# EAGLE design NanoMySens-v016 (EAGLE 7.6.0)
MAPLE-CUx Large Version
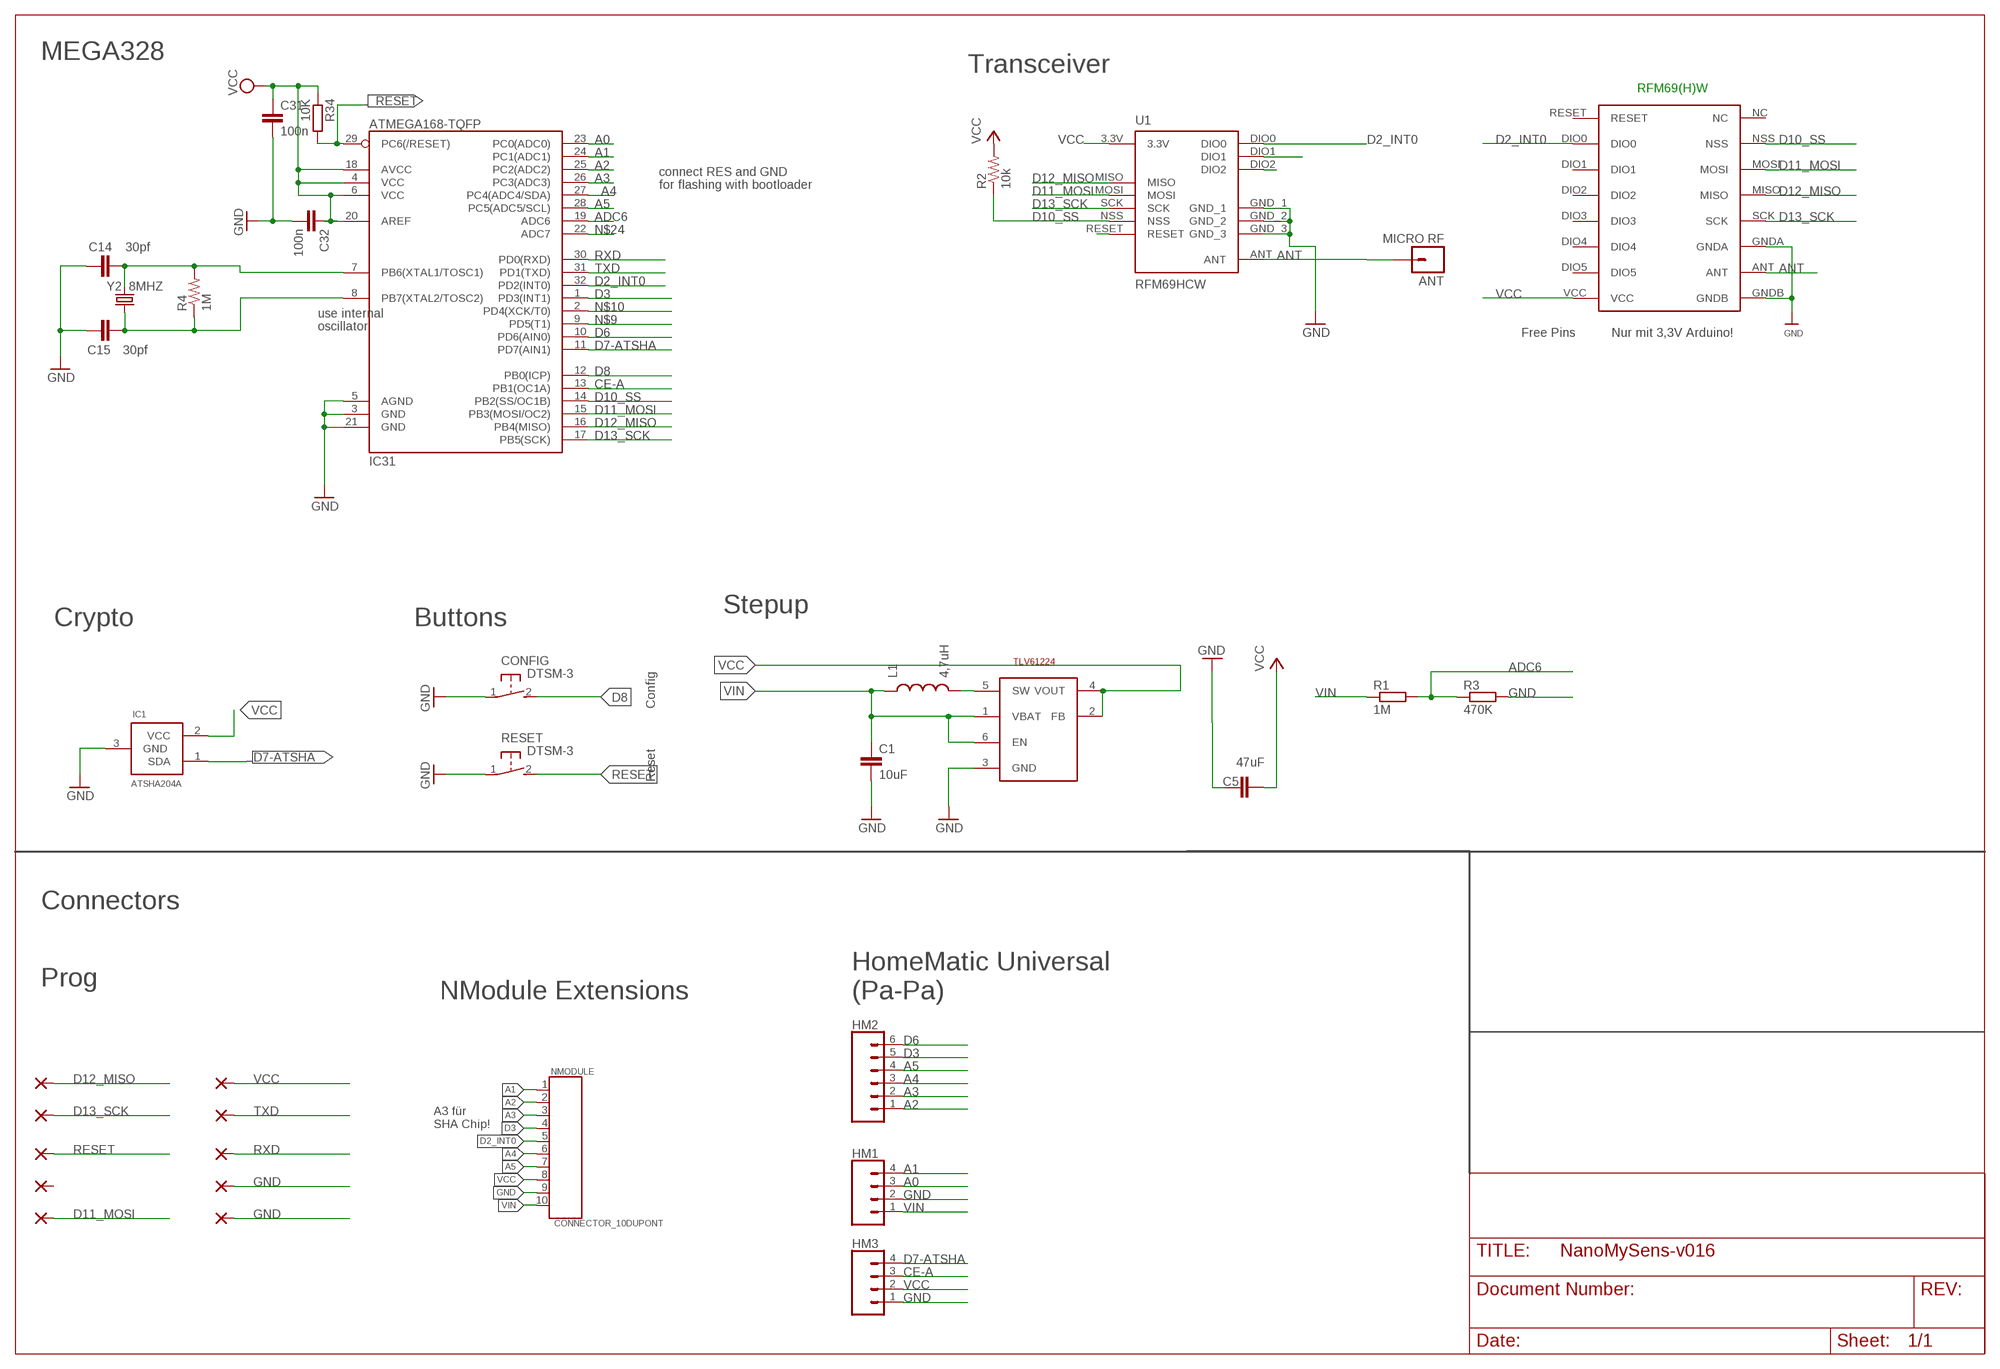
[diagram p0: schematic, sheet 1]

## Parts
ANT  MICRO RF  M01PTH  [1X01]
C1  10uF  CAP0805  [0805]
C5  47uF  C-EUC1210  [C1210]
C14  30pf  CAP0805  [0805]
C15  30pf  CAP0805  [0805]
C31  100n  C-EUC0805  [C0805]
C32  100n  C-EUC0805  [C0805]
CONFIG  DTSM-3  [DTSM-3]
GND  WIREPADSMD1,27-254  [SMD1,27-2,54]
GND2  WIREPADSMD1,27-254  [SMD1,27-2,54]
HM1  CONN_04  [1X04]
HM2  CONN_06SILK_FEMALE_PTH  [1X06]
HM3  CONN_04  [1X04]
IC1  ATSHA204A  [SOT23]
IC31  ATMEGA168-TQFP  [TQFP32-08]
L1  4,7uH  INDUCTOR0805  [0805]
MISO  WIREPADSMD1,27-254  [SMD1,27-2,54]
MOSI  WIREPADSMD1,27-254  [SMD1,27-2,54]
NC  WIREPADSMD1,27-254  [SMD1,27-2,54]
NMODULE  CONNECTOR_10DUPONT  [DUPONT_10]
R1  1M  R-EU_R0805  [R0805]
R2  10k  RESISTOR0805-RES  [0805]
R3  470K  R-EU_R0805  [R0805]
R4  1M  RESISTOR0805-RES  [0805]
R34  10K  R-EU_R0805  [R0805]
RESET  DTSM-3  [DTSM-3]
RFM69W  RFM69HW  [RFM]
RST  WIREPADSMD1,27-254  [SMD1,27-2,54]
RXD  WIREPADSMD1,27-254  [SMD1,27-2,54]
SCK  WIREPADSMD1,27-254  [SMD1,27-2,54]
STEPUP  TLV61224  TI-TLV61224  [SOT23-6L]
TXD  WIREPADSMD1,27-254  [SMD1,27-2,54]
U1  RFM69HCW  [RFM69HCW-XXXS2]
VCC  WIREPADSMD1,27-254  [SMD1,27-2,54]
Y2  8MHZ  CRYSTALTXC-7A  [CRYSTAL-TXC-7A]

## Nets
A0: HM1.3 IC31.23(PC0(ADC0))
A1: HM1.4 IC31.24(PC1(ADC1)) NMODULE.1
A2: HM2.1 IC31.25(PC2(ADC2)) NMODULE.2
A3: HM2.2 IC31.26(PC3(ADC3)) NMODULE.3
A4: HM2.3 IC31.27(PC4(ADC4/SDA)) NMODULE.6
A5: HM2.4 IC31.28(PC5(ADC5/SCL)) NMODULE.7
ADC6: IC31.19(ADC6) R1.2 R3.1
ANT: ANT.1 RFM69W.ANT U1.ANT
CE-A: HM3.3 IC31.13(PB1(OC1A))
D2_INT0: IC31.32(PD2(INT0)) NMODULE.5 RFM69W.DIO0 U1.DIO0
D3: HM2.5 IC31.1(PD3(INT1)) NMODULE.4
D6: HM2.6 IC31.10(PD6(AIN0))
D7-ATSHA: HM3.4 IC1.1(SDA) IC31.11(PD7(AIN1))
D8: CONFIG.2 IC31.12(PB0(ICP))
D10_SS: IC31.14(PB2(SS/OC1B)) R2.1 RFM69W.NSS U1.NSS
D11_MOSI: IC31.15(PB3(MOSI/OC2)) MOSI.1(P) RFM69W.MOSI U1.MOSI
D12_MISO: IC31.16(PB4(MISO)) MISO.1(P) RFM69W.MISO U1.MISO
D13_SCK: IC31.17(PB5(SCK)) RFM69W.SCK SCK.1(P) U1.SCK
GND [PWR]: C1.2 C5.1 C14.1 C15.1 C31.2 C32.2 CONFIG.1 GND2.1(P) GND.1(P) HM1.2 HM3.1 IC1.3(GND) IC31.3(GND) IC31.5(AGND) IC31.21(GND) NMODULE.9 R3.2 RESET.1 RFM69W.GNDA RFM69W.GNDB STEPUP.3(GND) U1.GND_1 U1.GND_2 U1.GND_3
N$3: C14.2 IC31.7(PB6(XTAL1/TOSC1)) R4.2 Y2.P$2
N$9: IC31.9(PD5(T1))
N$10: IC31.2(PD4(XCK/T0))
N$13: L1.2 STEPUP.5(SW)
N$14: U1.DIO2
N$15: U1.DIO1
N$16: U1.RESET
N$19: C15.2 IC31.8(PB7(XTAL2/TOSC2)) R4.1 Y2.P$1
N$24: IC31.22(ADC7)
RESET: IC31.29(PC6(/RESET)) R34.2 RESET.2 RST.1(P)
RXD: IC31.30(PD0(RXD)) RXD.1(P)
TXD: IC31.31(PD1(TXD)) TXD.1(P)
VCC [PWR]: C5.2 C31.1 C32.1 HM3.2 IC1.2(VCC) IC31.4(VCC) IC31.6(VCC) IC31.18(AVCC) IC31.20(AREF) NMODULE.8 R2.2 R34.1 RFM69W.VCC STEPUP.2(FB) STEPUP.4(VOUT) U1.3.3V VCC.1(P)
VIN [PWR]: C1.1 HM1.1 L1.1 NMODULE.10 R1.1 STEPUP.1(VBAT) STEPUP.6(EN)
Unconnected: NC.1(P) RFM69W.DIO1 RFM69W.DIO2 RFM69W.DIO3 RFM69W.DIO4 RFM69W.DIO5 RFM69W.NC RFM69W.RESET

## Notes on the sheet
- MEGA328
- Transceiver
- RFM69(H)W
- connect RES and GND
- for flashing with bootloader
- use internal
- oscillator
- Free Pins | Nur mit 3,3V Arduino!
- Stepup
- Crypto | Buttons
- Config
- Reset
- Connectors
- Prog
- NModule Extensions
- HomeMatic Universal
  (Pa-Pa)
- A3 für 
  SHA Chip!

## Library data of the parts
ANT = SparkFun-Connectors:M01: Header 1 Standard 1-pin 0.1" header. Use with straight break away headers (SKU : PRT-00116), right angle break away headers (PRT-00553), swiss pins (PRT-00743), machine pins (PRT-00117), and female headers (PRT-00115).
C1 = SparkFun-Passives:CAP: Capacitor Standard 0603 ceramic capacitor, and 0.1" leaded capacitor.
C5 C31 C32 = rcl:C-EU: CAPACITOR, European symbol
C14 C15 = doug:CAP: Capacitor Standard 0603 ceramic capacitor, and 0.1" leaded capacitor.
CONFIG RESET = mechanics:DTSM-3: Diptronics SMD button 6x3.5 mm
GND GND2 MISO MOSI NC RST RXD SCK TXD VCC = wirepad:WIREPAD: Wire PAD connect wire on PCB
HM1 HM3 = SparkFun-Connectors:CONN_04: Multi connection point. Often used as Generic Header-pin footprint for 0.1 inch spaced/style header connections On any of the 0.1 inch spaced packages, you can populate with these: Break Away Headers - Straight <https://www.sparkfun.com/products/116> (PRT-00116) Break Away Male Headers - Right Angle <https://www.sparkfun.com/products/553> (PRT-00553) Female Headers <https://www.sparkfun.com/products/115> (PRT-00115) Break Away Headers - Machine Pin <https://www.sparkfun.com/products/117> (PRT-00117) Break Away Female Headers - Swiss Machine Pin <https://www.sparkfun.com/products/743> (PRT-00743) For SCREWTERMINALS and SPRING TERMINALS visit here: Screw Terimnals on SparkFun.com <https://www.sparkfun.com/search/results?term=Screw+Terminals> (5mm/3.5mm/2.54mm spacing) This device is also useful as a general connection point to wire up your design to another part of your project. Our various solder wires solder well into these plated through hole pads. Hook-Up Wire - Assortment (Stranded, 22 AWG) <https://www.sparkfun.com/products/11375> (PRT-11375) Hook-Up Wire - Assortment (Solid Core, 22 AWG) <https://www.sparkfun.com/products/11367> (PRT-11367) View the entire wire category on our website here <https://www.sparkfun.com/categories/141> Special notes: Molex polarized connector foot print use with SKU : PRT-08231 with associated crimp pins and housings. 1MM SMD Version SKU: PRT-10208; PROD_ID: CONN-09696
HM2 = SparkFun-Connectors:CONN_06: Multi connection point. Often used as Generic Header-pin footprint for 0.1 inch spaced/style header connections On any of the 0.1 inch spaced packages, you can populate with these: Break Away Headers - Straight <https://www.sparkfun.com/products/116> (PRT-00116) Break Away Male Headers - Right Angle <https://www.sparkfun.com/products/553> (PRT-00553) Female Headers <https://www.sparkfun.com/products/115> (PRT-00115) Break Away Headers - Machine Pin <https://www.sparkfun.com/products/117> (PRT-00117) Break Away Female Headers - Swiss Machine Pin <https://www.sparkfun.com/products/743> (PRT-00743) Arduino Stackable Header - 6 Pin <https://www.sparkfun.com/products/9280> (PRT-09280) For SCREWTERMINALS and SPRING TERMINALS visit here: Screw Terimnals on SparkFun.com <https://www.sparkfun.com/search/results?term=Screw+Terminals> (5mm/3.5mm/2.54mm spacing) This device is also useful as a general connection point to wire up your design to another part of your project. Our various solder wires solder well into these plated through hole pads. Hook-Up Wire - Assortment (Stranded, 22 AWG) <https://www.sparkfun.com/products/11375> (PRT-11375) Hook-Up Wire - Assortment (Solid Core, 22 AWG) <https://www.sparkfun.com/products/11367> (PRT-11367) View the entire wire category on our website here <https://www.sparkfun.com/categories/141>; PROD_ID: CONN-08437
IC1 = Sensor:ATSHA204A
IC31 = atmel:ATMEGA168: Atmel Atmega 168/328/328P
L1 = SparkFun-Passives:INDUCTOR: Inductors Basic Inductor/Choke - 0603 and 1206. Footprints are not proven and vary greatly between part numbers.
NMODULE = TD-MySensors:CONNECTOR_10
R1 R3 R34 = rcl:R-EU_: RESISTOR, European symbol
R2 R4 = doug:RESISTOR: Resistor Basic schematic elements and footprints for 0603, 1206, and PTH resistors.
RFM69W = hoperf:RFM69HW
STEPUP = TLV61224:TI-TLV61224
U1 = doug:RFM69H
Y2 = SparkFun-FreqCtrl:CRYSTAL: Various standard crystals. Proven footprints.

## Net classes
0 default: width 0.305 mm
1 PWR: width 0.457 mm

## Board
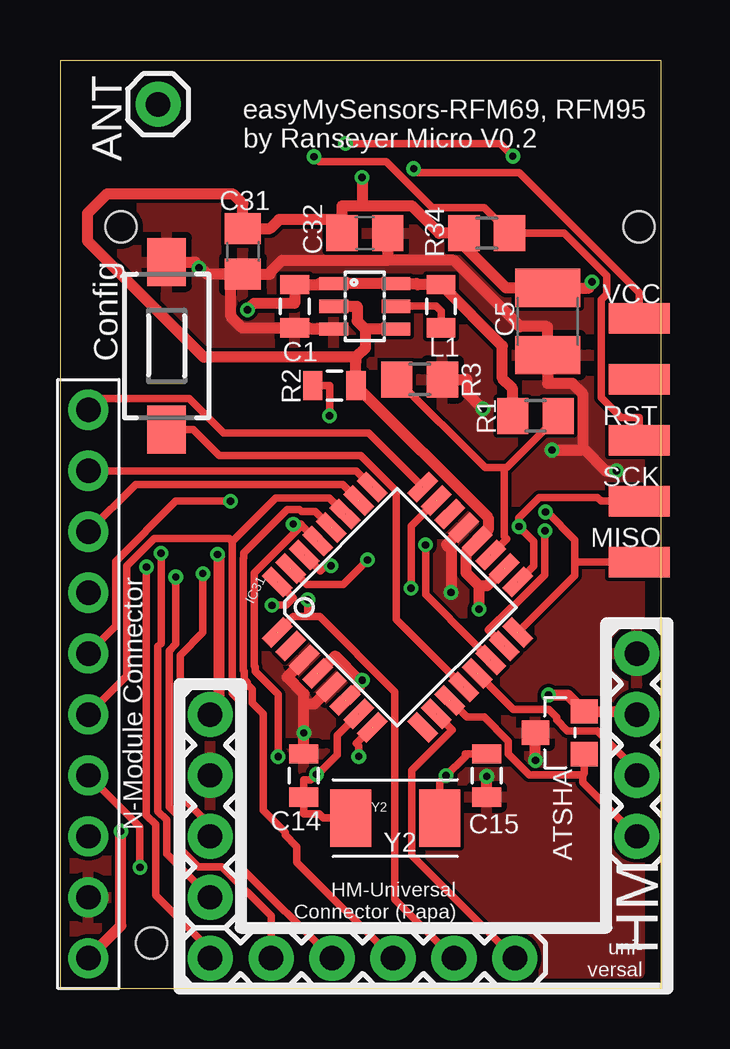
[diagram p1: board, top side]
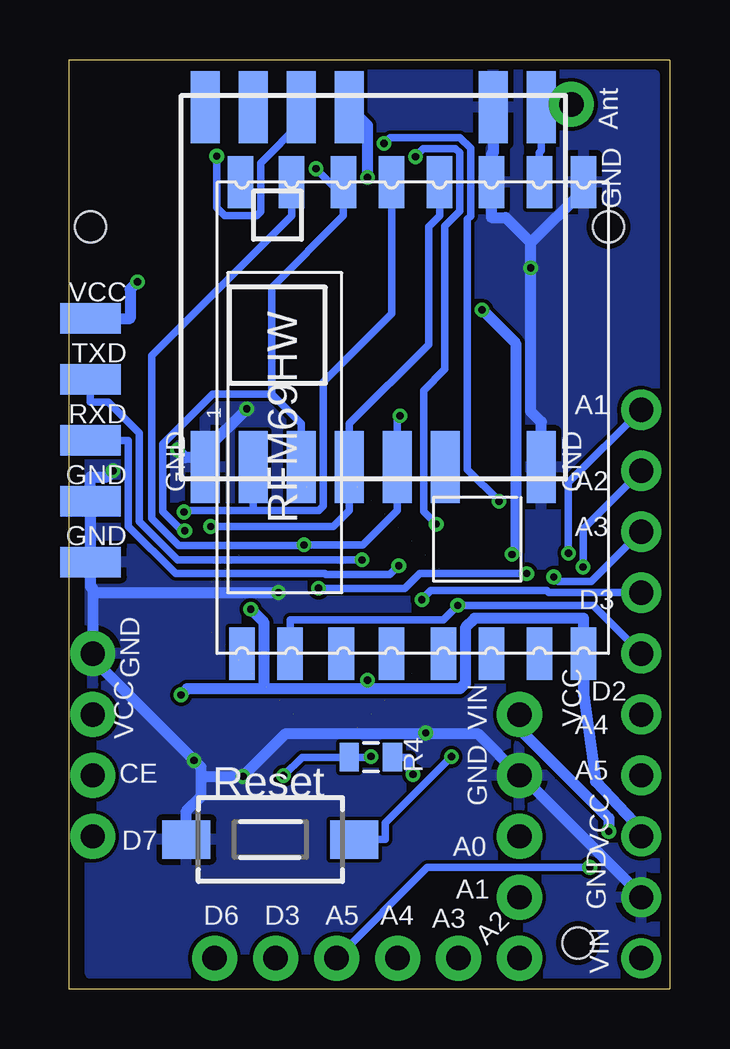
[diagram p2: board, bottom side, seen from below]

Size 25.04 x 38.72 mm. Coordinates in mm from the lower left corner, seen from the top.
Outline: 25.04,38.72 25.04,0 0,0 0,38.72 25.04,38.72
Copper layers (1*16): Top 0.035mm / dielectric 1.5mm / Bottom 0.035mm
Design rules "SeeedStudio_2layer_DRU_no_angle_20140221": minimum track width 6mil, minimum drill 12mil, track to track 6mil, track to pad 6mil, pad to pad 6mil, via to via 6mil, smd to smd 0mil, copper to edge 10mil, drill to drill 10mil, minimum pad ring 10mil, minimum via ring 6mil, stop-mask expansion 2mil, vias tented up to drill 100mil, thermal gap 10mil
Holes 1.3 mm at 24.13,31.75 2.54,31.75 3.81,1.91

### Footprints (pad centres in the part's own frame; a part is rotated, then mirrored left to right if it is on the bottom)
1X01 = drill 1.016 pad 1.88: 1 0,0
0805 = smd 0.8 x 1.2: 1 -0.9,0; 2 0.9,0
C1210 = smd 1.6 x 2.7: 1 -1.4,0; 2 1.4,0
C0805 = smd 1.3 x 1.5: 1 -0.95,0; 2 0.95,0
DTSM-3 = smd 2 x 1.6: 1 -3.494,0; 2 3.494,0
SMD1,27-2,54 = smd 1.27 x 2.54: 1 0,0
1X04 = drill 1.016 pad 1.88: 1 0,0; 2 2.54,0; 3 5.08,0; 4 7.62,0
1X06 = drill 1.016 pad 1.88: 1 0,0; 2 2.54,0; 3 5.08,0; 4 7.62,0; 5 10.16,0; 6 12.7,0
SOT23 = smd 1.016 x 1.143: 1 -0.889,-1.016; 2 0.889,-1.016; 3 0,1.016
TQFP32-08 = smd 1.27 x 0.559: 1 -4.293,2.8; 2 -4.293,2; 3 -4.293,1.2; 4 -4.293,0.4; 5 -4.293,-0.4; 6 -4.293,-1.2; 7 -4.293,-2; 8 -4.293,-2.8; 17 4.293,-2.8; 18 4.293,-2; 19 4.293,-1.2; 20 4.293,-0.4; 21 4.293,0.4; 22 4.293,1.2; 23 4.293,2; 24 4.293,2.8 | smd 0.559 x 1.27: 9 -2.8,-4.293; 10 -2,-4.293; 11 -1.2,-4.293; 12 -0.4,-4.293; 13 0.4,-4.293; 14 1.2,-4.293; 15 2,-4.293; 16 2.8,-4.293; 25 2.8,4.293; 26 2,4.293; 27 1.2,4.293; 28 0.4,4.293; 29 -0.4,4.293; 30 -1.2,4.293; 31 -2,4.293; 32 -2.8,4.293
DUPONT_10 = drill 1.016 pad 1.676: 1 1.27,1.27; 2 3.81,1.27; 3 6.35,1.27; 4 8.89,1.27; 5 11.43,1.27; 6 13.97,1.27; 7 16.51,1.27; 8 19.05,1.27; 9 21.59,1.27; 10 24.13,1.27
R0805 = smd 1.3 x 1.5: 1 -0.95,0; 2 0.95,0
RFM = smd 2.184 x 1.067: ANT 19.651,2.889; DIO0 0,13.27; DIO1 0,11.143; DIO2 0,9.047; DIO3 0,6.889; DIO4 0,4.889; DIO5 0,2.889; GNDA 19.651,4.889; GNDB 19.651,1.048; MISO 19.651,9.047; MOSI 19.651,11.047; NC 19.651,15.334; NSS 19.651,13.206; RESET 0,15.27; SCK 19.651,7.048; VCC 0,1.048
SOT23-6L = smd 0.55 x 1.2: 1 -0.95,-1.3; 2 0,-1.3; 3 0.95,-1.3; 4 0.95,1.3; 5 0,1.3; 6 -0.95,1.3
RFM69HCW-XXXS2 = smd 3 x 1.2: 3.3V 7.5,1; ANT 7.5,-7; DIO0 7.5,3; DIO1 7.5,5; DIO2 7.5,7; GND_1 7.5,-5; GND_2 -7.5,-7; GND_3 -7.5,7; MISO -7.5,5; MOSI -7.5,3; NSS -7.5,-1; RESET -7.5,-3; SCK -7.5,1
CRYSTAL-TXC-7A = smd 1.7 x 2.4: P$1 1.85,0; P$2 -1.85,0

### Placement (x,y rotation side)
ANT  4.09,36.87 0 top
C1  9.78,28.45 270 top
C5  20.32,27.81 90 top
C14  10.16,8.89 270 top
C15  17.78,8.89 90 top
C31  7.62,30.73 270 top
C32  12.7,31.5 0 top
CONFIG  4.45,26.8 270 top
GND  24.13,17.78 90 bottom
GND2  24.13,20.32 90 bottom
HM1  6.25,11.43 270 top
HM2  6.25,1.27 0 top
HM3  24.04,13.97 270 top
IC1  20.83,10.67 90 top
IC31  14.06,15.9 45 top
L1  15.88,28.45 270 top
MISO  24.13,17.78 90 top
MOSI  24.13,27.94 90 top
NC  24.13,25.4 90 top
NMODULE  -0.09,25.4 270 top
R1  19.81,23.88 0 top
R2  11.43,25.15 0 top
R3  14.99,25.4 0 top
R4  12.45,9.65 0 bottom
R34  17.78,31.5 0 top
RESET  16.64,6.22 0 bottom
RFM69W  2.54,13.97 90 bottom
RST  24.13,22.86 90 top
RXD  24.13,22.86 90 bottom
SCK  24.13,20.32 90 top
STEPUP  12.7,28.45 270 top
TXD  24.13,25.4 90 bottom
U1  12.35,29.25 90 bottom
VCC  24.13,27.94 90 bottom
Y2  13.97,7.11 0 top

### Tracks (layer width: path | path; a pad name or v marks a point on that pad's centre or on a via)
A0  (via drill 0.3 pad 0.61)  (1 unrouted)
  Top 0.305: v5.95,17.31 5.95,14.84 5.01,13.9 5.01,8.05 6.25,6.8 HM1.3 | IC31.23 14.63,19.29 v14.63,16.69
  Bottom 0.305: v14.63,16.69 11.04,16.69 10.42,17.31 v5.95,17.31
A1  (via drill 0.3 pad 0.61)  (1 unrouted)
  Top 0.305: v4.21,18.16 4.21,14.4 4.08,14.27 4.08,7.4 4.45,7.03 4.45,5.62 HM1.4 | IC31.24 12.86,23.17 6.82,23.17 5.38,24.61 1.66,24.61 NMODULE.1
  Bottom 0.305: NMODULE.1 4.21,21.1 v4.21,18.16
A2  (via drill 0.3 pad 0.61)  (1 unrouted)
  Top 0.305: v3.6,17.58 3.6,7.23 3.99,6.84 3.99,3.88 6.25,1.62 HM2.1 | NMODULE.2 12.33,21.59 12.34,21.58 IC31.25
  Bottom 0.305: NMODULE.2 3.6,19.17 v3.6,17.58
A3  (via drill 0.3 pad 0.61)  (1 unrouted)
  Top 0.305: v4.83,17.16 4.83,14.36 4.54,14.08 4.54,7.58 4.91,7.22 4.91,5.94 5.76,5.08 6.75,5.08 8.79,3.03 HM2.2 | NMODULE.3 3.15,21.02 11.78,21.02 IC31.26
  Bottom 0.305: NMODULE.3 3.26,16.97 4.63,16.97 v4.83,17.16
A4  (1 unrouted)
  Top 0.305: 7.18,18.64 7.05,18.77 3.92,18.77 2.78,17.63 2.78,13.03 NMODULE.6 | 7.18,18.64 7.18,12.31 7.5,11.99 7.5,5.11 HM2.3 | 7.18,18.64 8.98,20.45 11.21,20.45 IC31.27
A5  (via drill 0.3 pad 0.61)  (1 unrouted)
  Top 0.305: HM2.4 9.88,5.27 9.88,5.92 9.38,6.41 9.38,6.52 8.47,7.44 8.47,11.46 8.01,11.92 8.01,12.48 7.8,12.69 7.8,12.77 7.68,12.89 7.68,13.22 7.63,13.27 7.63,17.94 7.66,17.96 7.66,18.17 9.47,19.98 9.97,19.98 10.07,19.88 10.64,19.88 | 10.64,19.88 | NMODULE.7 3.33,6.75 v3.33,5.06 | IC31.28 10.64,19.88
  Bottom 0.305: HM2.4 10.09,5.06 v3.33,5.06
ADC6  (1 unrouted)
  Top 0.305: 18.51,21.72 18.61,21.72 R1.2 | R3.1 17.71,21.72 18.51,21.72 | 18.51,21.72 18.51,18.85 18.61,18.75 IC31.19
ANT
  Bottom 0.305: RFM69W.ANT 5.43,34.86 5.34,34.94 U1.ANT 4.21,36.74 ANT.1
CE-A  (1 unrouted)
  Top 0.305: HM3.3 24.04,9.1 22.39,10.74 21.14,10.74 20.69,11.2 20.69,11.3 20.36,11.63 18.89,11.63 18.05,12.48 IC31.13
D2_INT0  (via drill 0.3 pad 0.61)  (1 unrouted)
  Top 0.305: v11.9,35.23 18.34,35.23 v18.87,34.7 | NMODULE.5 2.33,15.11 2.33,17.82 4.83,20.32 v7.1,20.32 | v8.83,15.98 8.85,16 9.42,16 9.71,16.29 IC31.32
  Bottom 0.305: v7.1,20.32 8.43,21.65 8.43,32.08 8.29,32.21 8.29,35.03 8.74,35.48 11.65,35.48 v11.9,35.23 | v18.87,34.7 18.87,32.55 18.54,32.22 17.21,32.22 17.04,32.4 17.04,34.42 15.35,36.11 U1.DIO0 | NMODULE.5 3.19,15.98 v8.83,15.98 9.44,15.37 15.81,15.37 RFM69W.DIO0
D3  (via drill 0.3 pad 0.61)  (1 unrouted)
  Top 0.305: 10.32,15.51 10.81,15.51 13.96,12.37 13.96,3.73 HM2.5 | 10.32,15.51 9.71,15.51 IC31.1 | v10.32,16.21 10.32,15.51
  Bottom 0.305: NMODULE.4 5.03,16.51 5.12,16.59 9.94,16.59 v10.32,16.21
D6  (1 unrouted)
  Top 0.305: IC31.10 16.35,10.79 14.66,9.1 14.66,5.56 HM2.6
D7-ATSHA  (1 unrouted)
  Top 0.305: 21.78,8.9 21.84,8.97 IC1.1 | IC31.11 16.94,11.32 17.68,11.32 18.68,10.32 18.68,9.78 19.56,8.9 21.78,8.9 | 21.78,8.9 21.78,8.6 HM3.4
D8  (1 unrouted)
  Top 0.305: CONFIG.2 5.55,23.3 6.63,22.22 12.53,22.22 14.01,20.74 14.01,15.39 IC31.12
D10_SS  (via drill 0.3 pad 0.61)  (1 unrouted)
  Top 0.305: v15.23,18.5 15.23,16.43 17.28,14.38 IC31.14 | v11.23,23.88 11.23,25.15 R2.1
  Bottom 0.305: RFM69W.NSS 15.75,32.22 21.57,26.4 21.57,19.6 20.45,18.48 15.26,18.48 v15.23,18.5 12.79,18.5 11.35,19.94 U1.NSS 11.35,22.65 11.35,23.55 11.35,23.77 v11.23,23.88
D11_MOSI  (via drill 0.3 pad 0.61)  (1 unrouted)
  Top 0.305: MOSI.1 24.13,29.02 19.14,34.01 14.91,34.01 v14.74,34.19 | v20.2,19.09 20.2,17.25 18.85,15.9 18.8,15.9 17.85,14.94 IC31.15
  Bottom 0.305: 13.59,33.04 v14.74,34.19 | 13.59,33.04 13.59,32.22 16.58,29.24 16.58,24.78 | RFM69W.MOSI 13.59,33.04 | 16.58,24.78 19.04,24.78 21.11,22.7 21.11,19.89 20.32,19.09 v20.2,19.09 | 16.58,24.78 | 16.58,24.78 15.35,23.55 U1.MOSI
D12_MISO  (via drill 0.3 pad 0.61)  (1 unrouted)
  Top 0.305: 21.45,17.78 21.45,17.22 IC31.16 | 21.45,17.78 22.55,17.78 MISO.1 | v20.23,19.87 20.29,19.87 21.45,18.71 21.45,17.78
  Bottom 0.305: 17.34,19.94 20.16,19.94 v20.23,19.87 | RFM69W.MISO 11.59,28.13 14.44,25.28 14.44,20.12 14.62,19.94 17.34,19.94 | 17.34,19.94 17.34,20.11 U1.MISO
D13_SCK  (via drill 0.3 pad 0.61)  (1 unrouted)
  Top 0.305: SCK.1 22.55,20.32 22.39,20.48 19.97,20.48 19.12,19.63 v19.12,19.27 19.74,18.65 19.74,17.62 IC31.17
  Bottom 0.305: v19.12,19.27 14.02,19.27 13.35,19.94 U1.SCK 13.35,22.65 13.35,23.55 10.04,26.85 10.04,31.77 9.59,32.22 RFM69W.SCK
GND  (via drill 0.3 pad 0.61)
  Top 0.457: 10.16,11.86 10.16,12.29 9.46,13 IC31.3 | 10.16,11.86 v10.16,10.66 10.16,10.57 C14.1 | 10.16,11.86 10.59,11.86 IC31.5 | 21.79,22.53 22.74,21.59 v23.19,21.59 | v16.3,16.52 16.3,18.3 16.1,18.5 IC31.21 | 21.79,22.53 21.79,24.78 21.34,25.23 20.32,25.23 C5.1 20.32,27.59 19.18,27.59 16.41,30.36 13.65,30.36 | v20.5,22.45 21.71,22.45 21.79,22.53 | 7.12,29.78 6.13,29.78 5.83,30.09 | 7.12,29.78 C31.2 8.75,29.78 8.75,29.87 9.25,30.36 13.65,30.36 | 7.12,29.78 7.12,28.02 7.59,27.55 8.8,27.55 C1.2 10.37,27.55 10.42,27.5 STEPUP.3 | R3.2 16.97,25.4 16.97,24.82 v17.62,24.17 | v17.78,8.85 17.78,8.77 C15.1 | C32.2 13.65,30.36 | 5.83,30.09 5.63,30.29 CONFIG.1 | v5.79,30.04 5.83,30.09 | v19.81,9.52 IC1.3
  Bottom 0.457: v23.19,21.59 23.44,21.34 24.13,21.34 GND2.1 GND.1 24.13,16.76 24.04,16.67 24.04,16.52 | 24.04,16.52 v16.3,16.52 | NMODULE.9 1.18,3.88 6.19,8.89 HM1.2 8,10.64 10.16,10.64 | 24.04,16.52 HM3.1 24.04,13.74 v19.81,9.52 19.52,9.23 19.52,8.85 | 10.16,10.64 15.99,10.64 v17.78,8.85 19.52,8.85 | 10.16,10.64 v10.16,10.66 | 5.79,31.1 3.59,33.3 RFM69W.GNDB | 5.79,31.1 v5.79,30.04 5.79,24.07 5.34,23.63 U1.GND_2 | 5.79,31.1 6.83,32.15 7.43,32.15 RFM69W.GNDA 7.43,34.78 7.34,34.86 U1.GND_1 | 19.34,22.14 20.18,22.14 v20.5,22.45 | 19.34,22.14 19.34,22.52 | 19.34,22.52 19.34,22.53 19.26,22.53 v17.62,24.17 | U1.GND_3 19.34,22.13 | 19.34,22.13 19.34,22.14 | 19.52,8.85 19.52,8.01 20.13,7.4 RESET.1 | 19.34,22.13 19.34,22.52
  pour Bottom: 24.13,0.64 24.13,38.1 0.64,38.1 0.64,0.64
  pour Top: 0.64,0.64 0.64,38.1 24.13,38.1 24.13,0.64
N$3  (via drill 0.3 pad 0.61)  (1 unrouted)
  Top 0.305: Y2.P$2 10.96,7.11 10.79,7.29 10.16,7.29 C14.2 10.16,8.7 10.45,8.7 v10.69,8.93 10.74,8.93 11.55,9.75 11.55,10.56 IC31.7
  Bottom 0.305: v10.69,8.93 10.84,9.09 10.84,9.65 R4.2
N$13
  Top 0.305: L1.2 15.88,28.25 15.68,28.45 STEPUP.5
N$19  (via drill 0.3 pad 0.61)  (1 unrouted)
  Top 0.305: C15.2 16.88,9.79 16.88,9.67 v16.09,8.88 15.82,8.62 Y2.P$1 | IC31.8 12.34,10.22 12.45,10.12 v12.45,9.68
  Bottom 0.305: v16.09,8.88 15.32,9.65 14.05,9.65 R4.1 12.47,9.65 v12.45,9.68
RESET  (via drill 0.3 pad 0.61)  (1 unrouted)
  Top 0.305: v9.09,9.67 9.09,12.28 8.14,13.23 8.14,13.41 8.1,13.45 8.1,17.33 10.08,19.32 | v10.59,34.69 10.81,34.47 13.59,34.47 15.51,32.55 17.68,32.55 R34.2 21.01,31.5 22.79,29.71 22.79,28.96 22.55,28.73 22.55,24.63 23.39,23.8 24.13,23.8 RST.1 | v9.72,19.37 10.03,19.37 10.08,19.32 | IC31.29 10.08,19.32
  Bottom 0.305: v10.59,34.69 10.25,35.02 8.92,35.02 8.75,34.84 8.75,32.4 9.36,31.79 9.36,25.83 10.25,24.94 10.25,19.9 v9.72,19.37 | RESET.2 11.84,6.22 11.84,6.92 v9.09,9.67
RXD  (via drill 0.3 pad 0.61)  (1 unrouted)
  Top 0.305: v11.29,17.63 11.04,17.63 10.84,17.42 IC31.30
  Bottom 0.305: v11.29,17.63 11.65,17.26 14.33,17.26 14.37,17.3 20.58,17.3 22.55,19.28 22.55,22.86 RXD.1
TXD  (via drill 0.3 pad 0.61)  (1 unrouted)
  Top 0.305: v12.81,17.88 11.8,16.86 10.28,16.86 IC31.31
  Bottom 0.305: TXD.1 24.13,24.46 23.39,24.46 22.1,23.17 22.1,19.48 20.5,17.88 v12.81,17.88
VCC  (via drill 0.3 pad 0.61)  (3 unrouted)
  Top 0.457: 17.45,16.8 v17.45,15.82 | 17.45,16.8 16.91,17.34 16.91,18.19 IC31.20 17.84,19.12 17.84,19.63 R2.2 12.33,26.13 12.33,26.32 | 17.45,16.8 17.79,16.8 | 17.79,16.8 | IC31.18 17.79,16.8 | 12.33,26.32 6,26.32 1.15,31.17 1.15,32.33 1.97,33.14 7.2,33.14 7.62,32.72 C31.1 8.75,31.68 9.13,32.06 11.75,32.06 | 12.72,27.5 12.72,26.71 12.33,26.32 | 12.72,27.5 12.38,27.84 12.38,28.45 STEPUP.2 | 12.72,27.5 13.02,27.5 STEPUP.4 | 11.75,32.06 11.75,32.63 12.59,32.63 | C32.1 11.75,32.06 | 12.59,32.63 14.67,32.63 15.8,31.5 R34.1 16.83,30.97 18.59,29.21 C5.2 22.05,29.21 22.05,29.35 v22.17,29.47 | v12.59,33.81 12.59,32.63 | 12.49,12.84 11.46,13.87 IC31.4 | 12.49,12.84 12.49,12.64 12.31,12.46 IC31.6 | 12.49,12.84 12.52,12.86 v12.59,12.86 | v20.36,12.24 21.16,12.24 IC1.2 23.91,11.56 HM3.2
  Bottom 0.457: 16.9,12.5 16.9,15.26 v17.45,15.82 | 16.9,12.5 20.1,12.5 v20.36,12.24 | 12.59,12.5 16.9,12.5 | 3.59,12.24 3.59,12.5 3.59,12.83 | 3.59,12.24 3.08,8.64 1.18,6.62 NMODULE.8 | U1.3.3V 12.59,35.99 v12.59,33.81 | 12.59,12.5 v12.59,12.86 | 12.59,12.5 8.74,12.5 8.51,12.72 8.51,15.05 8.12,15.44 3.59,15.44 RFM69W.VCC 3.59,12.83 | VCC.1 22.48,27.94 22.48,29.16 v22.17,29.47 | 3.59,12.24 3.59,12.83
VIN  (via drill 0.3 pad 0.61)
  Top 0.457: HM1.1 6.64,11.81 6.64,18.03 v6.57,18.1 | NMODULE.10 2.53,2.62 v2.53,6.56 | v7.81,28.3 8.08,28.57 9.78,28.57 C1.1 10.76,29.35 10.81,29.4 STEPUP.1 13.02,29.4 13.98,29.4 STEPUP.6 14.84,29.4 14.89,29.35 L1.1 18.43,26.79 18.43,25.44 18.86,25.01 R1.1
  Bottom 0.457: v7.81,28.3 6.42,26.91 6.42,18.25 v6.57,18.1 | HM1.1 6.25,10.82 2.53,7.11 v2.53,6.56

### Text on the board
tPlace: HM | uni- / versal
tNames: easyMySensors-RFM69, RFM95 / by Ranseyer Micro V0.2 | C31 | C32 | R34 | VCC | C5 | Config | C1 | R3 | R2 | R1 | RST | SCK | MISO | N-Module Connector | C14 | Y2 | C15 | ATSHA | HM-Universal / Connector (Papa)
bNames: Ant | GND | VCC | TXD | A1 | RXD | A2 | GND | GND | GND | A3 | GND | D3 | D2 | GND | A4 | VCC | VIN | A5 | VCC | R4 | CE | GND | Reset | D7 | VCC | A0 | A1 | GND | A3 | A4 | A5 | D3 | D6 | A2 | VIN